# EAGLE design DPad-Buttons (EAGLE 9.6.2)
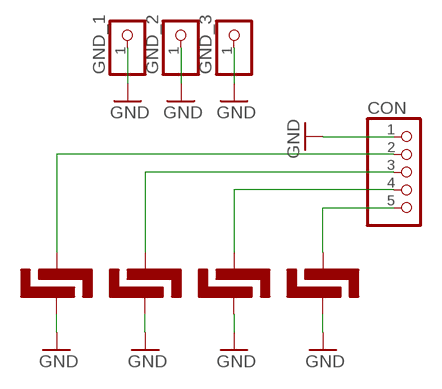
[diagram p0: schematic, sheet 1]

## Parts
BTN1  BTN_5MM_LONG  [BTN_5MM_LONG]
BTN2  BTN_5MM_LONG  [BTN_5MM_LONG]
BTN3  BTN_5MM_LONG  [BTN_5MM_LONG]
BTN4  BTN_5MM_LONG  [BTN_5MM_LONG]
CON  PINHD-1X5/90  [1X05/90]
GND_1  PINHD-1X1  [1X01]
GND_2  PINHD-1X1  [1X01]
GND_3  PINHD-1X1  [1X01]

## Nets
GND: BTN1.P$2 BTN2.P$2 BTN3.P$2 BTN4.P$2 CON.1 GND_1.1 GND_2.1 GND_3.1
N$1: BTN1.P$1 CON.2
N$2: BTN4.P$1 CON.5
N$3: BTN3.P$1 CON.4
N$4: BTN2.P$1 CON.3

## Library data of the parts
BTN1-BTN4 = surfacebuttons:BTN_5MM_LONG
CON = pinhead:PINHD-1X5: PIN HEADER
GND_1-GND_3 = pinhead:PINHD-1X1: PIN HEADER

## Board
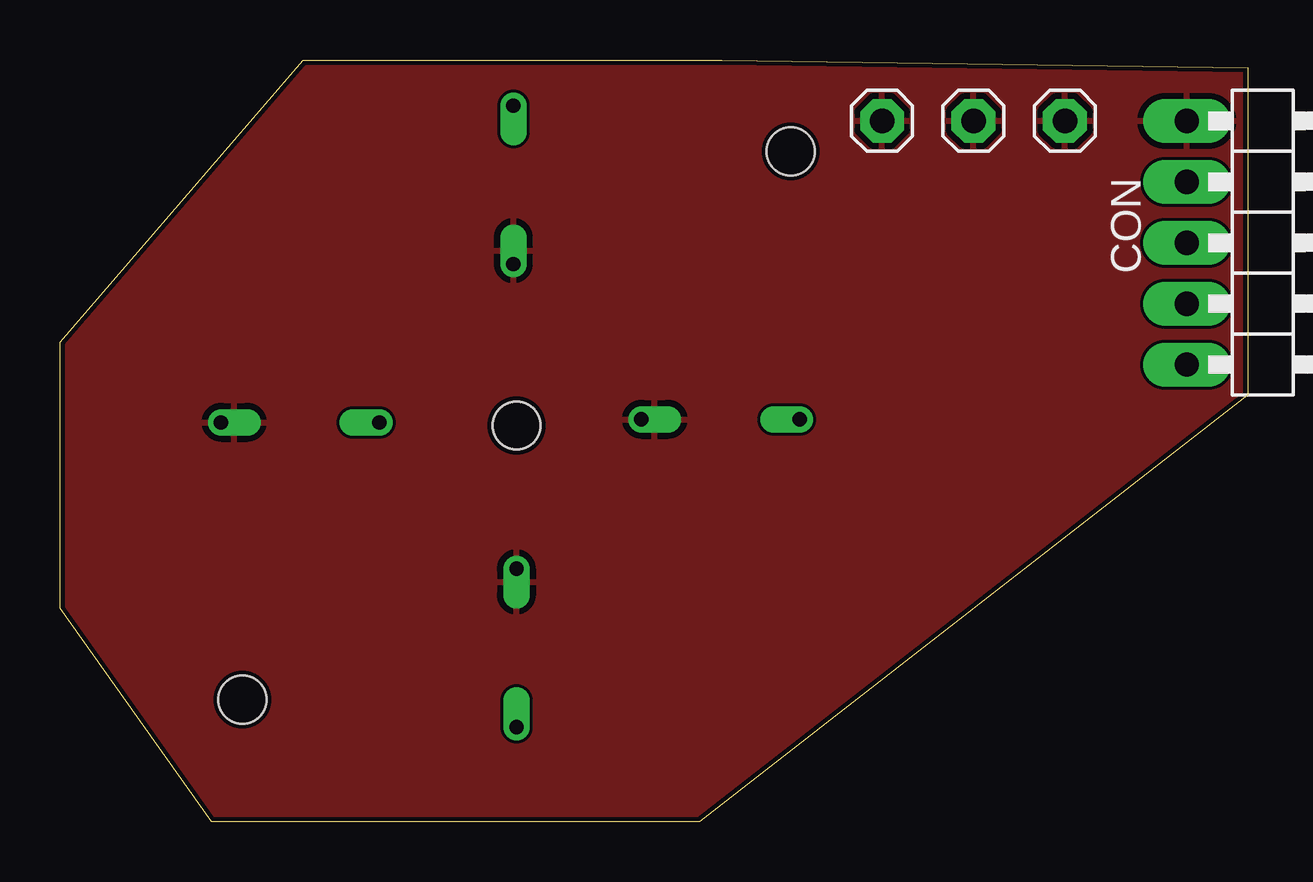
[diagram p1: board, top side]
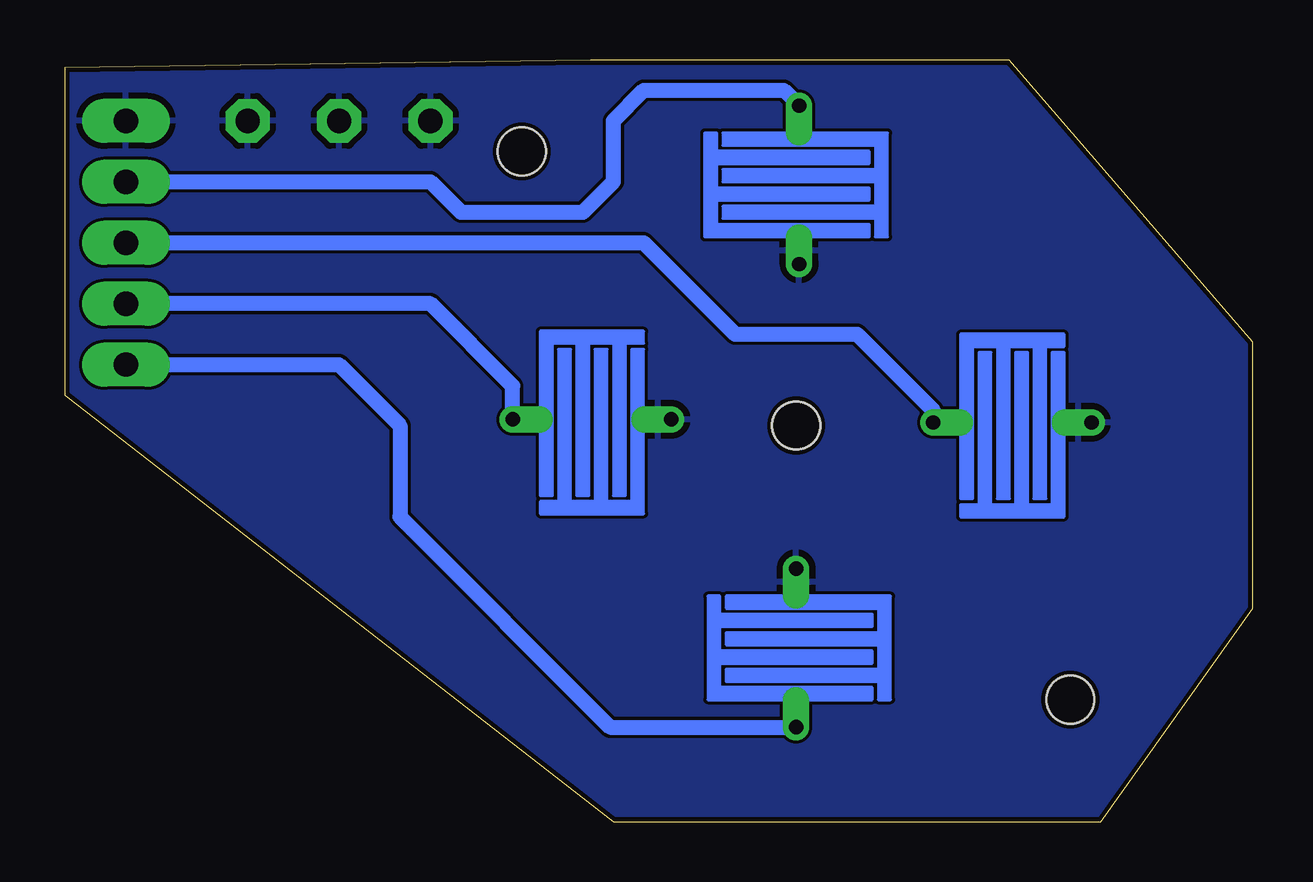
[diagram p2: board, bottom side, seen from below]

Size 49.51 x 31.75 mm. Coordinates in mm from the lower left corner, seen from the top.
Outline: 49.51,17.78 26.65,0 6.33,0 0,8.89 0,19.99 10.14,31.75 27.59,31.75 49.51,31.42 49.51,17.78
Copper layers (1*16): Top 0.035mm / dielectric 1.6mm / Bottom 0.035mm
Design rules "jlcpcb-2layers": minimum track width 5mil, minimum drill 0.3mm, track to track 5mil, track to pad 5mil, pad to pad 5mil, via to via 5mil, smd to smd 5mil, copper to edge 0.2mm, drill to drill 6mil, minimum pad ring 10mil, minimum via ring 3mil, stop-mask expansion 4mil, vias tented up to drill 0mil, thermal gap 10mil
Holes 2 mm at 30.46,27.94 7.6,5.08 19.03,16.51

### Footprints (pad centres in the part's own frame; a part is rotated, then mirrored left to right if it is on the bottom)
BTN_5MM_LONG = drill 0.6 offset: P$1 -3.175,-0.127; P$2 3.429,-0.127
1X05/90 = drill 1.016 long: 1 -5.08,-3.81; 2 -2.54,-3.81; 3 0,-3.81; 4 2.54,-3.81; 5 5.08,-3.81
1X01 = drill 1.016 octagon: 1 0,0

### Placement (x,y rotation side)
BTN1  19.03,26.67 270 top
BTN2  10.14,16.51 180 top
BTN3  27.67,16.64 180 top
BTN4  18.9,7.11 90 top
CON  50.78,24.13 270 top
GND_1  38.08,29.21 0 top
GND_2  34.27,29.21 0 top
GND_3  41.89,29.21 0 top

### Tracks (layer width: path | path; a pad name or v marks a point on that pad's centre or on a via)
GND
  pour Bottom: -1.29,36.83 -1.29,-1.27 49.51,-1.27 54.59,3.81 54.59,36.83
  pour Top: -1.29,36.83 54.59,36.83 54.59,3.81 49.51,-1.27 -1.29,-1.27
N$1
  Bottom 0.635: CON.2 34.27,26.67 33,25.4 27.92,25.4 26.65,26.67 26.65,29.21 25.38,30.48 19.54,30.48 BTN1.P$1
N$2
  Bottom 0.635: CON.5 38.08,19.05 35.54,16.51 35.54,12.7 26.78,3.94 BTN4.P$1
N$3
  Bottom 0.635: BTN3.P$1 30.84,18.16 34.27,21.59 CON.4
N$4
  Bottom 0.635: BTN2.P$1 13.32,17.14 16.49,20.32 21.57,20.32 25.38,24.13 CON.3